# Altium schematic sheet BlockDiagram.SchDoc
size A4; SheetNumber: 1; SheetTotal: 8
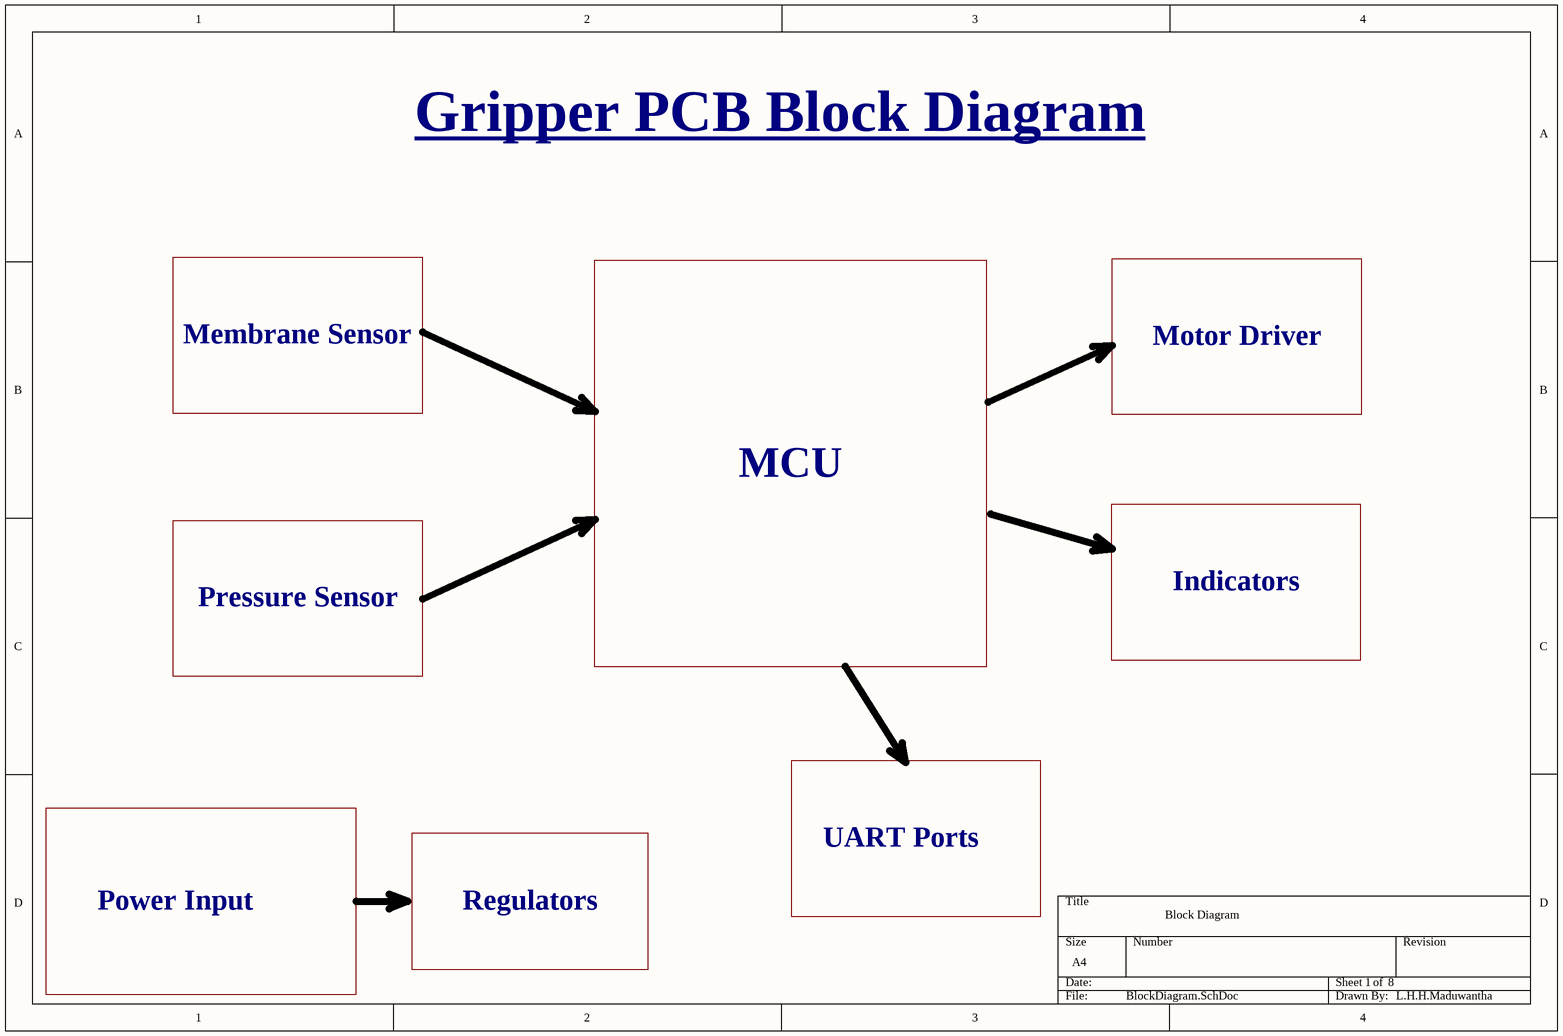
[diagram p0: BlockDiagram.SchDoc]

## Notes on the sheet
- Gripper PCB Block Diagram
- Membrane Sensor
- Motor Driver
- MCU
- Pressure Sensor
- Indicators
- UART Ports
- Power Input
- Regulators
- Block Diagram
- L.H.H.Maduwantha